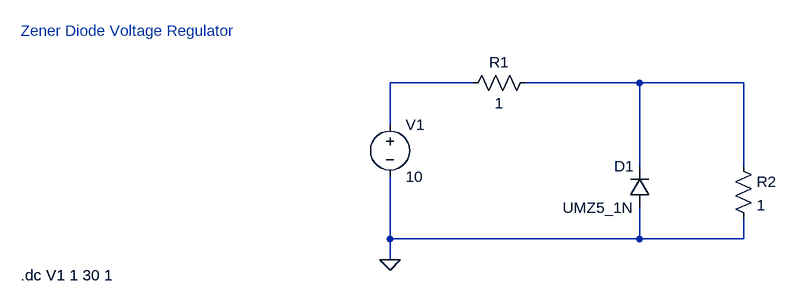
[diagram p0: schematic ZenerStabilisator.asc]
ZenerStabilisator.asc, the LTspice schematic file:
Version 4.1
SHEET 1 880 680
WIRE 48 80 -80 80
WIRE 304 80 128 80
WIRE 464 80 304 80
WIRE -80 144 -80 80
WIRE 304 208 304 80
WIRE 464 208 464 80
WIRE -80 320 -80 224
WIRE 304 320 304 272
WIRE 304 320 -80 320
WIRE 464 320 464 288
WIRE 464 320 304 320
WIRE -80 352 -80 320
FLAG -80 352 0
SYMBOL voltage -80 128 R0
WINDOW 123 0 0 Left 0
WINDOW 39 0 0 Left 0
SYMATTR InstName V1
SYMATTR Value 10
SYMBOL res 144 64 R90
WINDOW 0 0 56 VBottom 2
WINDOW 3 32 56 VTop 2
SYMATTR InstName R1
SYMATTR Value 1
SYMBOL res 448 192 R0
SYMATTR InstName R2
SYMATTR Value 1
SYMBOL diode 320 272 R180
WINDOW 0 24 64 Left 2
WINDOW 3 24 0 Left 2
SYMATTR InstName D1
SYMATTR Value UMZ5_1N
SYMATTR Description Diode
SYMATTR Type diode
TEXT -648 0 Left 2 ;Zener Diode Voltage Regulator
TEXT -648 376 Left 2 !.dc V1 1 30 1

The netlist it stands for:
* ZenerStabilisator.asc
V1 N001 0 10
R1 N002 N001 1
R2 N002 0 1
D1 0 N002 UMZ5_1N
.model D D
.lib standard.dio
* Zener Diode Voltage Regulator
.dc V1 1 30 1
.backanno
.end